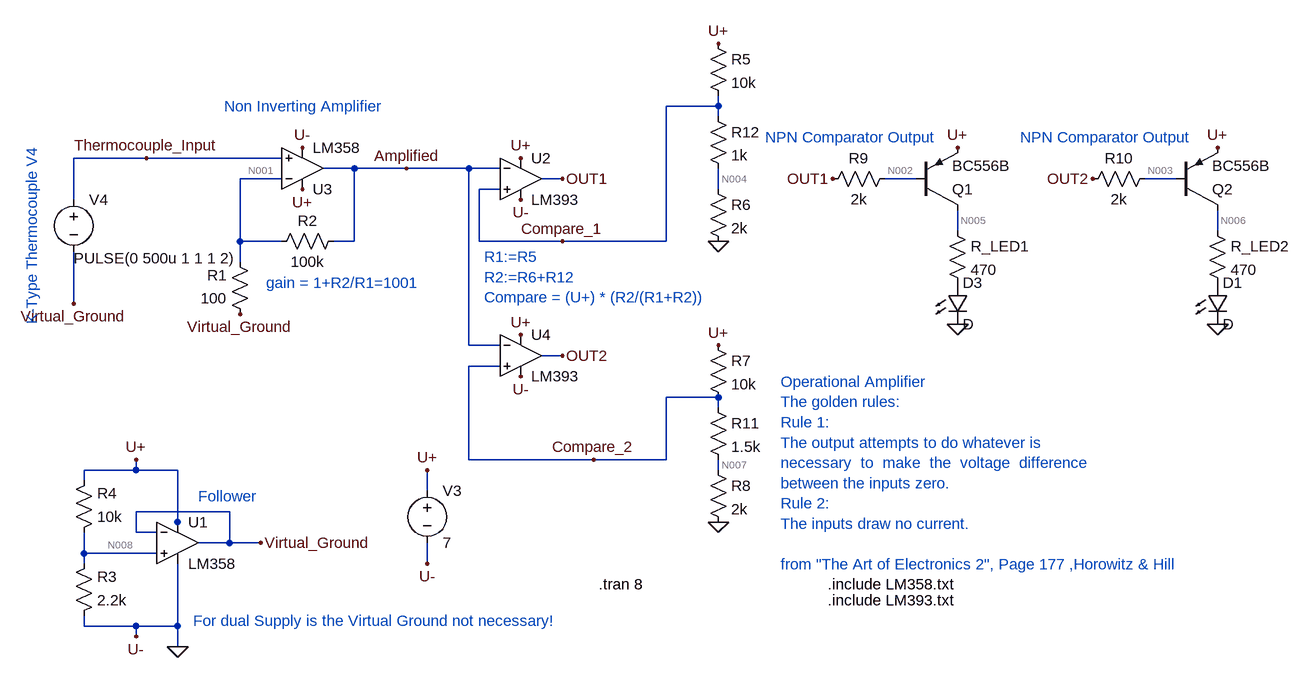
[diagram p0: schematic LTSpice_Example_002.asc]
LTSpice_Example_002.asc, the LTspice schematic file:
Version 4
SHEET 1 1220 888
WIRE 240 0 240 -16
WIRE 240 0 160 0
WIRE 240 16 240 0
WIRE -640 80 -752 80
WIRE -432 80 -640 80
WIRE -320 96 -368 96
WIRE -240 96 -320 96
WIRE -144 96 -240 96
WIRE -96 96 -144 96
WIRE -432 112 -496 112
WIRE 0 112 -32 112
WIRE 544 112 496 112
WIRE 944 112 896 112
WIRE -96 128 -128 128
WIRE 240 128 240 96
WIRE -752 144 -752 80
WIRE 608 192 608 160
WIRE 1008 192 1008 160
WIRE -496 208 -496 112
WIRE -432 208 -496 208
WIRE -320 208 -320 96
WIRE -320 208 -352 208
WIRE -128 208 -128 128
WIRE 0 208 -128 208
WIRE 160 208 160 0
WIRE 160 208 0 208
WIRE -496 240 -496 208
WIRE -752 304 -752 224
WIRE -144 368 -144 96
WIRE -96 368 -144 368
WIRE 0 384 -32 384
WIRE -96 400 -144 400
WIRE 240 448 160 448
WIRE 240 464 240 448
WIRE -144 544 -144 400
WIRE 48 544 -144 544
WIRE 160 544 160 448
WIRE 160 544 48 544
WIRE -656 560 -656 544
WIRE -656 560 -736 560
WIRE -592 560 -656 560
WIRE 240 560 240 544
WIRE -736 576 -736 560
WIRE -208 592 -208 560
WIRE -512 624 -656 624
WIRE -592 640 -592 560
WIRE -656 656 -656 624
WIRE -624 656 -656 656
WIRE -592 656 -592 640
WIRE -512 672 -512 624
WIRE -512 672 -560 672
WIRE -464 672 -512 672
WIRE -736 688 -736 656
WIRE -624 688 -736 688
WIRE -736 704 -736 688
WIRE -208 704 -208 672
WIRE -736 800 -736 784
WIRE -656 800 -736 800
WIRE -592 800 -592 704
WIRE -592 800 -656 800
WIRE -656 816 -656 800
WIRE -592 832 -592 800
FLAG -208 560 U+
FLAG -208 704 U-
FLAG -656 816 U-
FLAG -656 544 U+
FLAG -464 672 Virtual_Ground
FLAG -400 64 U-
FLAG -400 128 U+
FLAG -64 144 U-
FLAG -64 416 U-
FLAG -64 80 U+
FLAG -64 352 U+
FLAG -640 80 Thermocouple_Input
FLAG -240 96 Amplified
FLAG 240 -96 U+
FLAG 240 368 U+
FLAG 240 208 0
FLAG 240 640 0
FLAG -592 832 0
FLAG 0 112 OUT1
FLAG 0 384 OUT2
FLAG 608 336 0
FLAG 416 112 OUT1
FLAG 608 64 U+
FLAG 0 208 Compare_1
FLAG -496 320 Virtual_Ground
FLAG -752 304 Virtual_Ground
FLAG 48 544 Compare_2
FLAG 1008 336 0
FLAG 816 112 OUT2
FLAG 1008 64 U+
SYMBOL voltage -208 576 R0
WINDOW 123 0 0 Left 2
WINDOW 39 0 0 Left 2
SYMATTR InstName V3
SYMATTR Value 7
SYMBOL Opamps\\opamp2 -592 608 R0
SYMATTR InstName U1
SYMATTR Value LM358
SYMBOL voltage -752 128 R0
WINDOW 123 0 0 Left 2
WINDOW 39 0 0 Left 2
WINDOW 3 0 106 Left 2
SYMATTR Value PULSE(0 500u 1 1 1 2)
SYMATTR InstName V4
SYMBOL res -752 800 M180
WINDOW 0 36 76 Left 2
WINDOW 3 36 40 Left 2
SYMATTR InstName R3
SYMATTR Value 2.2k
SYMBOL res -752 672 M180
WINDOW 0 36 76 Left 2
WINDOW 3 36 40 Left 2
SYMATTR InstName R4
SYMATTR Value 10k
SYMBOL Opamps\\opamp2 -400 160 M180
SYMATTR InstName U3
SYMATTR Value LM358
SYMBOL Opamps\\opamp2 -64 48 R0
SYMATTR InstName U2
SYMATTR Value LM393
SYMBOL res -480 336 R180
WINDOW 0 36 76 Left 2
WINDOW 3 36 40 Left 2
SYMATTR InstName R1
SYMATTR Value 100
SYMBOL res -336 192 R90
WINDOW 0 0 56 VBottom 2
WINDOW 3 32 56 VTop 2
SYMATTR InstName R2
SYMATTR Value 100k
SYMBOL Opamps\\opamp2 -64 320 R0
SYMATTR InstName U4
SYMATTR Value LM393
SYMBOL res 224 -112 R0
SYMATTR InstName R5
SYMATTR Value 10k
SYMBOL res 224 112 R0
SYMATTR InstName R6
SYMATTR Value 2k
SYMBOL res 224 352 R0
SYMATTR InstName R7
SYMATTR Value 10k
SYMBOL res 224 544 R0
SYMATTR InstName R8
SYMATTR Value 2k
SYMBOL res 512 96 R90
WINDOW 0 0 56 VBottom 2
WINDOW 3 32 56 VTop 2
SYMATTR InstName R9
SYMATTR Value 2k
SYMBOL LED 592 272 R0
SYMATTR InstName D3
SYMBOL res 592 176 R0
SYMATTR InstName R_LED1
SYMATTR Value 470
SYMBOL pnp 544 160 M180
SYMATTR InstName Q1
SYMATTR Value BC556B
SYMBOL res 224 448 R0
SYMATTR InstName R11
SYMATTR Value 1.5k
SYMBOL res 224 0 R0
SYMATTR InstName R12
SYMATTR Value 1k
SYMBOL res 912 96 R90
WINDOW 0 0 56 VBottom 2
WINDOW 3 32 56 VTop 2
SYMATTR InstName R10
SYMATTR Value 2k
SYMBOL LED 992 272 R0
SYMATTR InstName D1
SYMBOL res 992 176 R0
SYMATTR InstName R_LED2
SYMATTR Value 470
SYMBOL pnp 944 160 M180
SYMATTR InstName Q2
SYMATTR Value BC556B
TEXT 56 736 Left 2 !.tran 8
TEXT 408 760 Left 2 !.include LM393.txt
TEXT 408 736 Left 2 !.include LM358.txt
TEXT -520 0 Left 2 ;Non Inverting Amplifier
TEXT -560 600 Left 2 ;Follower
TEXT 312 48 Left 2 ;NPN Comparator Output
TEXT -456 272 Left 2 ;gain = 1+R2/R1=1001
TEXT -120 232 Left 2 ;R1:=R5\nR2:=R6+R12\nCompare = (U+) * (R2/(R1+R2))
TEXT -816 336 VLeft 2 ;K-Type Thermocouple V4
TEXT 336 424 Left 2 ;Operational Amplifier\nThe golden rules:\nRule 1: \nThe output attempts to do whatever is \nnecessary  to  make  the  voltage  difference \nbetween the inputs zero. \nRule 2: \nThe inputs draw no current. \n \nfrom "The Art of Electronics 2", Page 177 ,Horowitz & Hill
TEXT -568 792 Left 2 ;For dual Supply is the Virtual Ground not necessary!
TEXT 704 48 Left 2 ;NPN Comparator Output

The netlist it stands for:
* LTSpice_Example_002.asc
V3 U+ 0 7
XU1 N008 Virtual_Ground U+ 0 Virtual_Ground LM358  ; pins In+ In- V+ V- OUT
V4 Thermocouple_Input Virtual_Ground PULSE(0 500u 1 1 1 2)
R3 0 N008 2.2k
R4 N008 U+ 10k
XU3 Thermocouple_Input N001 U+ 0 Amplified LM358  ; pins In+ In- V+ V- OUT
XU2 Compare_1 Amplified U+ 0 OUT1 LM393  ; pins In+ In- V+ V- OUT
R1 Virtual_Ground N001 100
R2 Amplified N001 100k
XU4 Compare_2 Amplified U+ 0 OUT2 LM393  ; pins In+ In- V+ V- OUT
R5 U+ Compare_1 10k
R6 N004 0 2k
R7 U+ Compare_2 10k
R8 N007 0 2k
R9 N002 OUT1 2k
D3 P001 0 D
R_LED1 N005 P001 470
Q1 N005 N002 U+ 0 BC556B
R11 Compare_2 N007 1.5k
R12 Compare_1 N004 1k
R10 N003 OUT2 2k
D1 P002 0 D
R_LED2 N006 P002 470
Q2 N006 N003 U+ 0 BC556B
.model D D
.lib standard.dio
.model NPN NPN
.model PNP PNP
.lib standard.bjt
.tran 8
.include LM393.txt
.include LM358.txt
* Non Inverting Amplifier
* Follower
* NPN Comparator Output
* gain = 1+R2/R1=1001
* R1:=R5
* R2:=R6+R12
* Compare = (U+) * (R2/(R1+R2))
* K-Type Thermocouple V4
* Operational Amplifier
* The golden rules:
* Rule 1:
* The output attempts to do whatever is
* necessary  to  make  the  voltage  difference
* between the inputs zero.
* Rule 2:
* The inputs draw no current.
* from "The Art of Electronics 2", Page 177 ,Horowitz & Hill
* For dual Supply is the Virtual Ground not necessary!
* NPN Comparator Output
.backanno
.end

* Results of the author's LTspice run, read from the files saved beside the schematic
* Operating Point, zero values left out:
*   V(u+) = 7 V
*   V(virtual_ground) = 1.262 V
*   V(n008) = 1.262 V
*   V(thermocouple_input) = 1.262 V
*   V(amplified) = 1.373 V
*   V(n001) = 1.263 V
*   V(compare_1) = 1.615 V
*   V(out1) = 6.734 V
*   V(compare_2) = 1.815 V
*   V(out2) = 6.734 V
*   V(n004) = 1.077 V
*   V(n007) = 1.037 V
*   V(n002) = 6.734 V
*   V(p001) = 305.4 mV
*   V(n005) = 305.4 mV
*   V(n003) = 6.734 V
*   V(p002) = 305.4 mV
*   V(n006) = 305.4 mV
*   Ic(Q2) = -1.341 nA
*   Ib(Q2) = -6.718 pA
*   Ie(Q2) = 1.347 nA
*   Ic(Q1) = -1.341 nA
*   Ib(Q1) = -6.717 pA
*   Ie(Q1) = 1.347 nA
*   I(D1) = 1.341 nA
*   I(D3) = 1.341 nA
*   I(R_led2) = 1.341 nA
*   I(R10) = 6.719 pA
*   I(R12) = 538.5 µA
*   I(R11) = 518.5 µA
*   I(R_led1) = 1.341 nA
*   I(R9) = 6.719 pA
*   I(R8) = 518.5 µA
*   I(R7) = 518.5 µA
*   I(R6) = 538.5 µA
*   I(R5) = 538.5 µA
*   I(R2) = 1.109 µA
*   I(R1) = -1.129 µA
*   I(R4) = -573.8 µA
*   I(R3) = -573.8 µA
*   I(V4) = 20.19 nA
*   I(V3) = -2.615 mA
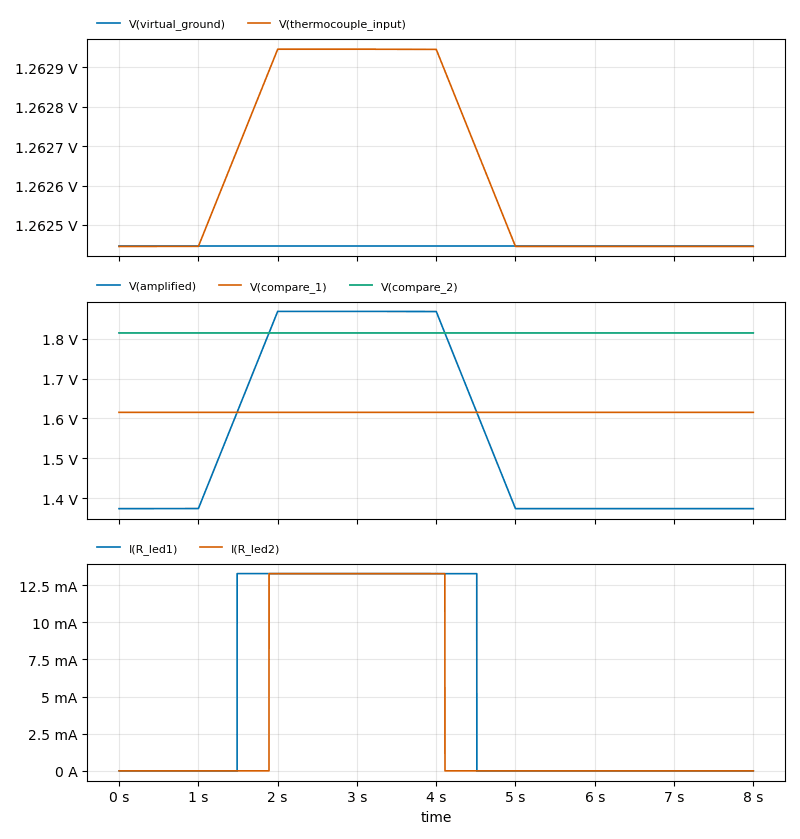
[diagram p1: Transient Analysis of LTSpice_Example_002.asc, plotted from the saved traces]
* Transient Analysis, 1 run:
*   V(virtual_ground): min 1.262 V, max 1.262 V, average 1.262 V, rms 1.262 V, last 1.262 V
*   V(thermocouple_input): min 1.262 V, max 1.263 V, average 1.263 V, rms 1.263 V, last 1.262 V
*   V(amplified): min 1.373 V, max 1.869 V, average 1.559 V, rms 1.574 V, last 1.373 V
*   V(compare_1): min 1.615 V, max 1.615 V, average 1.615 V, rms 1.615 V, last 1.615 V
*   V(compare_2): min 1.815 V, max 1.815 V, average 1.815 V, rms 1.815 V, last 1.815 V
*   I(R_led1): min 0 A, max 13.28 mA, average 5.018 mA, rms 8.163 mA, last 1.341 nA
*   I(R_led2): min 0 A, max 13.28 mA, average 3.682 mA, rms 6.992 mA, last 1.341 nA